# Altium schematic sheet MCU_tiva.SchDoc
size A4
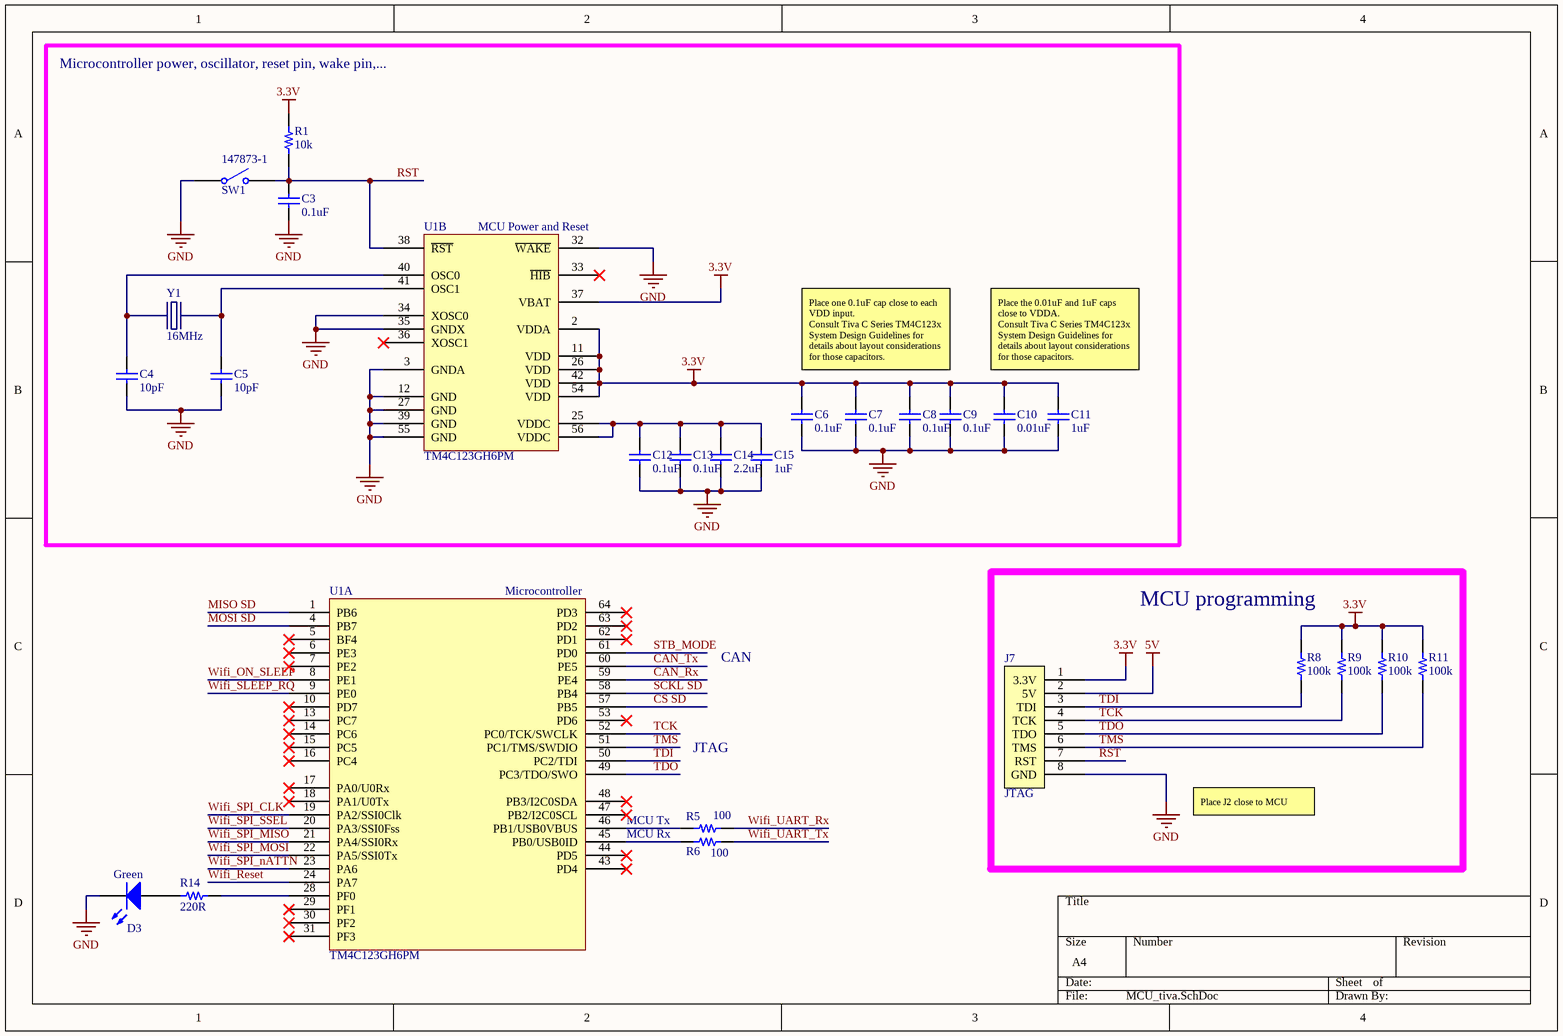
[diagram p0: MCU_tiva.SchDoc]

## Parts
C3  value 0.1uF  [C0603]  (hidden comment: CAP CER 0603 0.1uF 50V C0G 10%)
C4  value 10pF  [C0603]  (hidden comment: CAP CER 0603 10pF 50V C0G 5%)
C5  value 10pF  [C0603]  (hidden comment: CAP CER 0603 10pF 50V C0G 5%)
C6  value 0.1uF  [C0603]  (hidden comment: CAP CER 0603 0.1uF 50V C0G 10%)
C7  value 0.1uF  [C0603]  (hidden comment: CAP CER 0603 0.1uF 50V C0G 10%)
C8  value 0.1uF  [C0603]  (hidden comment: CAP CER 0603 0.1uF 50V C0G 10%)
C9  value 0.1uF  [C0603]  (hidden comment: CAP CER 0603 0.1uF 50V C0G 10%)
C10  value 0.01uF  [C0603]  (hidden comment: CAP CER 0603 0.01uF 50V X7R 10%)
C11  value 1uF  [C0603]  (hidden comment: CAP CER 0603 1uF 25V X7R 20%)
C12  value 0.1uF  [C0603]  (hidden comment: CAP CER 0603 0.1uF 50V C0G 10%)
C13  value 0.1uF  [C0603]  (hidden comment: CAP CER 0603 0.1uF 50V C0G 10%)
C14  value 2.2uF  [C0603]  (hidden comment: CAP CER 0603 2.2uF 6.3V X7R 10%)
C15  value 1uF  [C0603]  (hidden comment: CAP CER 0603 1uF 25V X7R 20%)
D3  Green  [LED1206]
J7  JTAG  [JTAG_Header]
R1  value 10k  [R0603]  (hidden comment: RES 0603 10k 5% 0.1W)
R5  value 100  [R0603]  (hidden comment: RES 0603 100R 5% 1/4W)
R6  value 100  [R0603]  (hidden comment: RES 0603 100R 5% 1/4W)
R8  value 100k  [R0603]  (hidden comment: RES 0603 100k 5% 0.1W)
R9  value 100k  [R0603]  (hidden comment: RES 0603 100k 5% 0.1W)
R10  value 100k  [R0603]  (hidden comment: RES 0603 100k 5% 0.1W)
R11  value 100k  [R0603]  (hidden comment: RES 0603 100k 5% 0.1W)
R14  value 220R  [R0603]  (hidden comment: RES 0603 220R 5% 1/4W)
SW1  147873-1  [147873]
U1  Microcontroller  Part_Number: TM4C123GH6PM  [LQFP64]  (parts A,B of 2)
Y1  value 16MHz  [NX5032GA]  (hidden comment: NX5043GA-16.00MHz)

## Blocks framed on the sheet
Microcontroller power, oscillator, reset pin, wake pin,...: C3-C15 R1 SW1 U1 Y1
MCU programming: J7 R8-R11

## Nets
3.3V: C6.2 C7.2 C8.2 C9.2 C10.2 C11.2 J7.1(3.3V) R1.2 R8.2 R9.2 R10.2 R11.2 U1.2(VDDA) U1.11(VDD) U1.26(VDD) U1.37(VBAT) U1.42(VDD) U1.54(VDD)
5V: J7.2(5V)
GND: C3.1 C4.1 C5.1 C6.1 C7.1 C8.1 C9.1 C10.1 C11.1 C12.1 C13.1 C14.1 C15.1 D3.2(K) J7.8(GND) SW1.1(COMMON) U1.3(GNDA) U1.12(GND) U1.27(GND) U1.32(~{WAKE}) U1.34(XOSC0) U1.35(GNDX) U1.39(GND) U1.55(GND)
CAN_Rx: U1.59(PE4)
CAN_Tx: U1.60(PE5)
CS SD: U1.57(PB5)
MISO SD: U1.1(PB6)
MOSI SD: U1.4(PB7)
RST: C3.2 J7.7(RST) R1.1 SW1.2(NO) U1.38(~{RST})
SCKL SD: U1.58(PB4)
STB_MODE: U1.61(PD0)
TCK: J7.4(TCK) R9.1 U1.52(PC0/TCK/SWCLK)
TDI: J7.3(TDI) R8.1 U1.50(PC2/TDI)
TDO: J7.5(TDO) R10.1 U1.49(PC3/TDO/SWO)
TMS: J7.6(TMS) R11.1 U1.51(PC1/TMS/SWDIO)
Wifi_ON_SLEEP: U1.8(PE1)
Wifi_Reset: U1.24(PA7)
Wifi_SLEEP_RQ: U1.9(PE0)
Wifi_SPI_CLK: U1.19(PA2/SSI0Clk)
Wifi_SPI_MISO: U1.21(PA4/SSI0Rx)
Wifi_SPI_MOSI: U1.22(PA5/SSI0Tx)
Wifi_SPI_nATTN: U1.23(PA6)
Wifi_SPI_SSEL: U1.20(PA3/SSI0Fss)
Wifi_UART_Rx: R5.1
Wifi_UART_Tx: R6.1
NetC4_2: C4.2 U1.40(OSC0) Y1.1
NetC5_2: C5.2 U1.41(OSC1) Y1.2
NetC12_2: C12.2 C13.2 C14.2 C15.2 U1.25(VDDC) U1.56(VDDC)
NetD3_1: D3.1(A) R14.1
NetR5_2: R5.2 U1.46(PB1/USB0VBUS)
NetR6_2: R6.2 U1.45(PB0/USB0ID)
NetR14_2: R14.2 U1.28(PF0)

Not connected (* = marked no-connect by the designer): U1 5(BF4)* 6(PE3)* 7(PE2)* 10(PD7)* 13(PC7)* 14(PC6)* 15(PC5)* 16(PC4)* 17(PA0/U0Rx)* 18(PA1/U0Tx)* 29(PF1)* 30(PF2)* 31(PF3)* 33(~{HIB})* 36(XOSC1)* 43(PD4)* 44(PD5)* 47(PB2/I2C0SCL)* 48(PB3/I2C0SDA)* 53(PD6)* 62(PD1)* 63(PD2)* 64(PD3)*

## Notes on the sheet
- Place one 0.1uF cap close to each VDD input.
  Consult Tiva C Series TM4C123x System Design Guidelines for details about layout considerations for those capacitors.
- Place the 0.01uF and 1uF caps close to VDDA.
  Consult Tiva C Series TM4C123x System Design Guidelines for details about layout considerations for those capacitors.
- CAN
- JTAG
- MCU Rx
- MCU Tx
- Place J2 close to MCU

## Library data of the parts
C3 C6-C9 C12 C13 = CAP CER 0603 0.1uF 50V C0G 10%: 0.1uF ceramic capacitor; Manufacturer: TDK Corporation; Part_Number: CGA3E2X7R1H104K080AA; Supplier_Link: http://www.digikey.ca/product-detail/en/CGA3E2X7R1H104K080AA/445-5666-1-ND/2443706; Tolerance: 10%; Voltage rating: 50V; Price: 0.14; Price_10: 0.102
C4 C5 = CAP CER 0603 10pF 50V C0G 5%: 10pF ceramic capacitor; Manufacturer: TDK Corporation; Part_Number: CGA3E2C0G1H100D080AA; Supplier_Link: http://www.digikey.ca/product-detail/en/CGA3E2C0G1H100D080AA/445-5628-1-ND/2443668; Tolerance: 5%; Voltage rating: 50V; Price: 0.14; Price_10: 0.077
C10 = CAP CER 0603 0.01uF 50V X7R 10%: 0.01uF ceramic capacitor; Manufacturer: TDK Corporation; Part_Number: CGA3E2X7R1H103K080AA; Supplier_Link: http://www.digikey.ca/product-detail/en/CGA3E2X7R1H103K080AA/445-5662-1-ND/2443702; Tolerance: 10%; Voltage rating: 50V; Price: 0.14; Price_10: 0.102
C11 C15 = CAP CER 0603 1uF 25V X7R 20%: 1uF ceramic capacitor; Manufacturer: TDK Corporation; Part_Number: CGA3E1X7R1E105M080AC; Supplier_Link: http://www.digikey.ca/product-detail/en/CGA3E1X7R1E105M080AC/445-12548-1-ND/3954214; Tolerance: 20%; Voltage rating: 25V; Price: 0.24; Price_10: 0.171
C14 = CAP CER 0603 2.2uF 6.3V X7R 10%: 2.2uF ceramic capacitor; Manufacturer: TDK Corporation; Part_Number: CGA3E1X7R0J225K080AC; Supplier_Link: http://www.digikey.ca/product-detail/en/CGA3E1X7R0J225K080AC/445-6933-1-ND/2672951; Tolerance: 10%; Voltage rating: 6.3V; Price: 0.34; Price_10: 0.235
D3 = LTST-C150KGKT: Green LED 1206; Manufacturer: Liteon; Part_Number: LTST-C150KGKT; Supplier_Link: http://www.digikey.ca/product-detail/en/LTST-C150KGKT/160-1404-1-ND/386759; Price: 0.55; Price_10: 0.40
J7 = JTAG_Header: JTAG header, MCU programming
R1 = RES 0603 10k 5% 0.1W: 10 kOhms resistor; Part_Number: CRCW060310K0JNEA; Manufacturer: Vishay; Price: 0.15; Supplier_Link: http://www.digikey.ca/product-detail/en/CRCW060310K0JNEA/541-10KGCT-ND/1179393; Price_10: 0.033
R5 R6 = RES 0603 100R 5% 1/4W: 100 Ohms resistor, 1/4W; Part_Number: ESR03EZPJ101; Manufacturer: Rohm Semiconductor; Price: 0.15; Supplier_Link: http://www.digikey.ca/product-detail/en/ESR03EZPJ101/RHM100DCT-ND/1983776; Price_10: 0.12
R8-R11 = RES 0603 100k 5% 0.1W: 100 kOhm resistor; Part_Number: CRCW0603100KJNEA; Manufacturer: Vishay; Price: 0.15; Supplier_Link: http://www.digikey.ca/product-detail/en/CRCW0603100KJNEA/541-100KGCT-ND/1179417; Price_10: 0.033
R14 = RES 0603 220R 5% 1/4W: 220 Ohms resistor, 1/4W; Part_Number: ESR03EZPJ221; Manufacturer: Rohm Semiconductor; Price: 0.15; Supplier_Link: http://www.digikey.ca/product-detail/en/ESR03EZPJ221/RHM220DCT-ND/1983788; Price_10: 0.12
SW1 = 147873-1: Pushbutton switch SPST, 2 pins; Manufacturer: TE Connectivity; Supplier_Link: http://ca.mouser.com/ProductDetail/TE-Connectivity-Alcoswitch/147873-1/?qs=sGAEpiMZZMvxtGF7dlGNpsxRhg8g8FqHC2R98arEfD8%3d; Price: 0.30; Part_Number: 147873-1
U1 = TM4C123GN6PM: 32 bit Microcontroller; Manufacturer: Texas Instrument; Price: 8.50; Supplier_Link: http://www.ti.com/product/TM4C123GH6PM/samplebuy
Y1 = NX5043GA-16.00MHz: Crystal Oscillator 16 MHz; Manufacturer: NDK; Part_Number: NX5032GA-16.000M-LN-CD-1; ESR: 120 Ohms; Supplier_Link: http://www.digikey.ca/product-detail/en/NX5032GA-16.000000MHZ-LN-CD-1/644-1037-1-ND/1128909; Price: 0.95; Price_10: 0.796